# Altium schematic sheet DriverPrototype2.SchDoc: Title
size B; Organization: Midnight Sun Solar Rayce Car Team; Address1: University of Waterloo; Address2: 200 University Ave W; Address3: Waterloo, ON, Canada; Address4: N2L 3E9; Website: www.uwmidsun.com; ProjectName: ProjectName
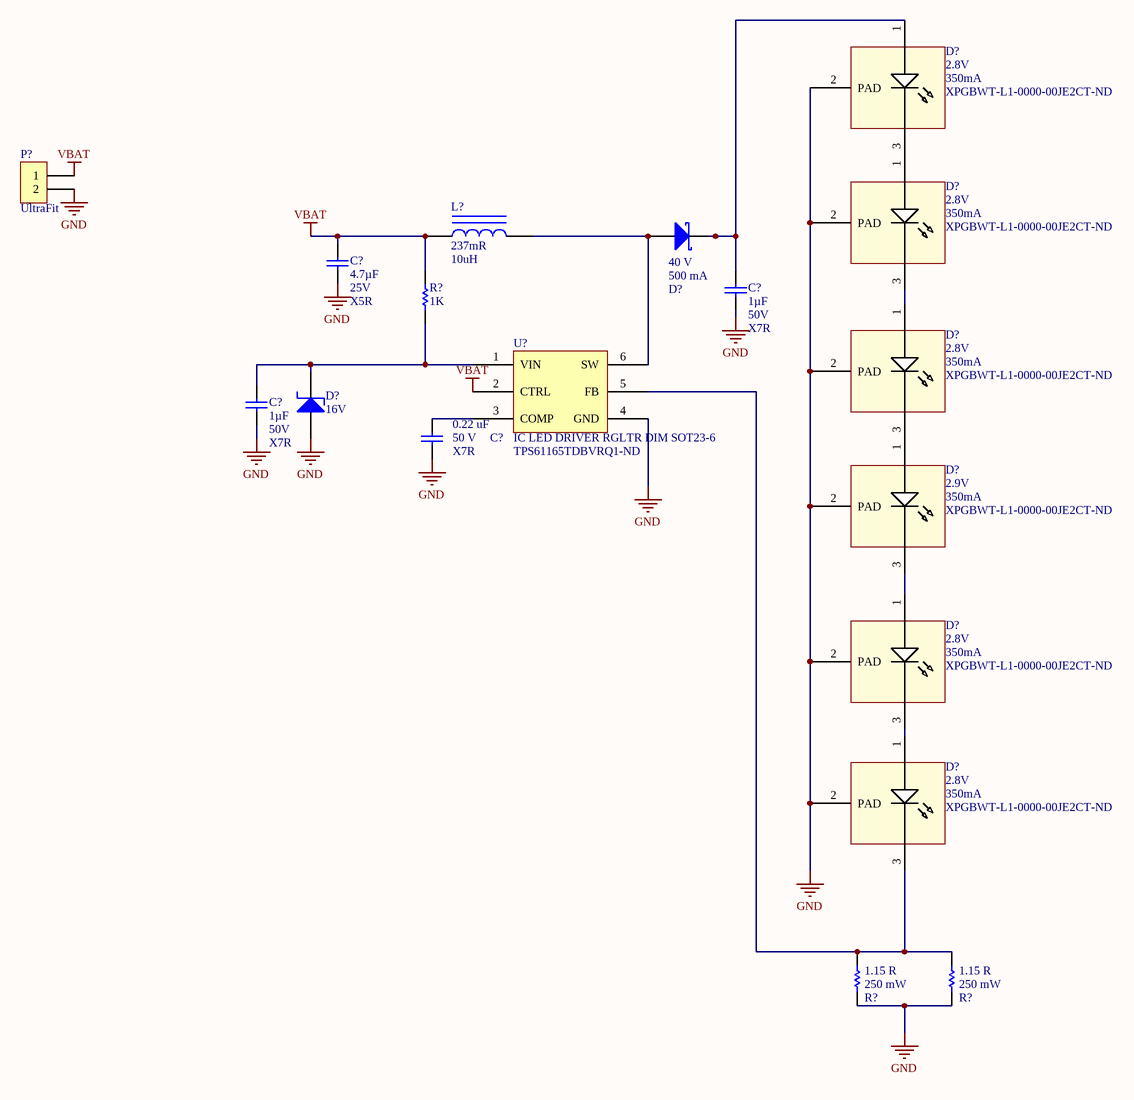
[diagram p0: DriverPrototype2.SchDoc]

## Parts
(Parts that share a designator on the sheet are numbered #1, #2 ... from top to bottom, then left to right.)
C?#1  Capacitance: 4.7µF  Voltage: 25V  Temperature Coefficient: X5R  [CAP, 0603]  (hidden comment: CAP CER 4.7UF 25V 10% X5R 0603)
C?#2  Capacitance: 1µF  Voltage: 50V  Temperature Coefficient: X7R  [CAP, 0603]  (hidden comment: CAP CER 1UF 50V 10% X7R 0603)
C?#3  Capacitance: 1µF  Voltage: 50V  Temperature Coefficient: X7R  [CAP, 0603]  (hidden comment: CAP CER 1UF 50V 10% X7R 0603)
C?#4  CAP CER 0.22UF 50V X7R 0805  [CAP, 0805]  (value not drawn)
D?#1  Forward Voltage: 2.8V  Test Current: 350mA  Supplier Part Number 1: XPGBWT-L1-0000-00JE2CT-ND  [LED CREE XP-E2 1414 2-SMD]  (hidden comment: LED XLAMP COOL WHITE 5700K 2SMD)
D?#2  Forward Voltage: 2.8V  Test Current: 350mA  Supplier Part Number 1: XPGBWT-L1-0000-00JE2CT-ND  [LED CREE XP-E2 1414 2-SMD]  (hidden comment: LED XLAMP COOL WHITE 5700K 2SMD)
D?#3  DIODE SCHOTTKY 40V 500MA SOD123  [SOD123]  (value not drawn)
D?#4  Forward Voltage: 2.8V  Test Current: 350mA  Supplier Part Number 1: XPGBWT-L1-0000-00JE2CT-ND  [LED CREE XP-E2 1414 2-SMD]  (hidden comment: LED XLAMP COOL WHITE 5700K 2SMD)
D?#5  Voltage - Zener (Nom): 16V  [DO-214AA Diode]  (hidden comment: DIODE ZENER 16V 5W DO-214AA (SMB))
D?#6  Forward Voltage: 2.9V  Test Current: 350mA  Supplier Part Number 1: XPGBWT-L1-0000-00JE2CT-ND  [LED CREE XP-E2 1414 2-SMD]  (hidden comment: LED XLAMP COOL WHITE 5700K 2SMD)
D?#7  Forward Voltage: 2.8V  Test Current: 350mA  Supplier Part Number 1: XPGBWT-L1-0000-00JE2CT-ND  [LED CREE XP-E2 1414 2-SMD]  (hidden comment: LED XLAMP COOL WHITE 5700K 2SMD)
D?#8  Forward Voltage: 2.8V  Test Current: 350mA  Supplier Part Number 1: XPGBWT-L1-0000-00JE2CT-ND  [LED CREE XP-E2 1414 2-SMD]  (hidden comment: LED XLAMP COOL WHITE 5700K 2SMD)
L?  DC Resistance (DCR): 237mR  Inductance: 10uH  [INDP5050X20N]  (hidden comment: FIXED IND 10UH 1.13A 237 MOHM)
P?  Series: UltraFit  [CONN, 2POS ULTRA-FIT]  (hidden comment: CONN 2POS ULTRA-FIT 0.138")
R?#1  1K  [RES, 0603]
R?#2  RES SMD 1.15 OHM 1% 1/4W 1206  [RES 1206]  (value not drawn)
R?#3  RES SMD 1.15 OHM 1% 1/4W 1206  [RES 1206]  (value not drawn)
U?  IC LED DRIVER RGLTR DIM SOT23-6  Supplier Part Number 1: TPS61165TDBVRQ1-ND  [SOT23-6_N]

## Nets
GND: C?#1.2 C?#2.2 C?#3.2 C?#4.2 D?#1.2(PAD) D?#2.2(PAD) D?#4.2(PAD) D?#5.1(A) D?#6.2(PAD) D?#7.2(PAD) D?#8.2(PAD) P?.2 R?#2.2 R?#3.2 U?.4(GND)
VBAT: C?#1.1 L?.1 P?.1 R?#1.1 U?.2(CTRL)
NetC?#2_1: C?#2.1 D?#1.1(A) D?#3.2(K)
NetC?#3_1: C?#3.1 D?#5.2(K) R?#1.2 U?.1(VIN)
NetC?#4_1: C?#4.1 U?.3(COMP)
NetD?#1_3: D?#1.3(K) D?#2.1(A)
NetD?#2_3: D?#2.3(K) D?#4.1(A)
NetD?#3_1: D?#3.1(A) L?.2 U?.6(SW)
NetD?#4_3: D?#4.3(K) D?#6.1(A)
NetD?#6_3: D?#6.3(K) D?#7.1(A)
NetD?#7_3: D?#7.3(K) D?#8.1(A)
NetD?#8_3: D?#8.3(K) R?#2.1 R?#3.1 U?.5(FB)

## Notes on the sheet
- PROJECT
- DOCUMENT
- DRAWN BY
- LAST MODIFIED
- PART NUMBER
- REVISION
- SHEET
- VARIANT
- OF
- Engineering 5 - 1002
  University of Waterloo
  (519) 888-4567 x32978
  hardware@uwmidsun.com
- (in symbol CAP CER 0.22UF 50V X7R 0805) 0.22 uF; 50 V
- (in symbol DIODE SCHOTTKY 40V 500MA SOD123) 40 V; 500 mA
- (in symbol RES SMD 1.15 OHM 1% 1/4W 1206) 1.15 R; 250 mW

## Library data of the parts
C?#1 = CAP CER 4.7UF 25V 10% X5R 0603: 4.7µF ±10% 25V Ceramic Capacitor X5R 0603 (1608 Metric); Manufacturer 1: Murata Electronics North America; Manufacturer Part Number 1: GRM188R61E475KE11D; Supplier 1: Digi-Key; Supplier Part Number 1: 490-7203-1-ND; Packaging: Cut Tape (CT); Part Status: Active; Operating Temperature: -55°C ~ 85°C; Ratings: -; Mounting Type: Surface Mount, MLCC; Package / Case: 0603 (1608 Metric); Size / Dimension: 0.063" L x 0.031" W (1.60mm x 0.80mm); Height - Seated (Max): -; Thickness (Max): 0.031" (0.80mm); Lead Spacing: -; Lead Style: -; ComponentLink1URL: http://www.murata.com/~/media/webrenewal/support/library/catalog/products/capacitor/mlcc/c02e.ashx; ComponentLink1Description: http://www.murata.com/~/media/webrenewal/support/library/catalog/products/capacitor/mlcc/c02e.ashx; Tolerance: ±10%
C?#2 C?#3 = CAP CER 1UF 50V 10% X7R 0603: 1µF ±10% 50V Ceramic Capacitor X7R 0603 (1608 Metric); Manufacturer 1: Taiyo Yuden; Manufacturer Part Number 1: UMK107AB7105KA-T; Supplier 1: Digi-Key; Supplier Part Number 1: 587-3247-1-ND; Packaging: Cut Tape (CT); Part Status: Active; Operating Temperature: -55°C ~ 125°C; Ratings: -; Mounting Type: Surface Mount, MLCC; Package / Case: 0603 (1608 Metric); Size / Dimension: 0.063" L x 0.031" W (1.60mm x 0.80mm); Height - Seated (Max): -; Thickness (Max): 0.037" (0.95mm); Lead Spacing: -; Lead Style: -; ComponentLink1URL: http://www.yuden.co.jp/productdata/catalog/en/mlcc_all_e.pdf; ComponentLink1Description: http://www.yuden.co.jp/productdata/catalog/en/mlcc_all_e.pdf; Tolerance: ±10%
C?#4 = CAP CER 0.22UF 50V X7R 0805: Manufacturer: Samsung; Manufacturer Part Number: CL21B224KBFNNNE; Tolerance: 10%; Capacitance: 220nF; Supplier 1: Digi-Key; Stock 1: 219478; Pricing 1: 1=0.11, 10=0.077, 100=0.0361, 500=0.02532, 1000=0.02096 (USD); Mount: Surface Mount; Case/Package: 0805; Case Code (Metric): 2012; Case Code (Imperial): 0805; Contact Plating: Tin; Min Operating Temperature: -55°C; Max Operating Temperature: 125°C; Voltage Rating: 50V; Package Quantity: 1; Packaging: Tape and Reel; Dielectric: X7R; Voltage Rating (DC): 50V; Voltage: 50V; Length: 2mm; Height: 1.25mm; Width: 0.049inch; Thickness: 0.053inch; Depth: 1.25mm; Radiation Hardening: No; Lead Free: Lead Free; ComponentLink1URL: https://www.verical.com/server-webapp/html/getDatasheet?partID=358363&src-supplier=Verical; ComponentLink1Description: https://www.verical.com/server-webapp/html/getDatasheet?partID=358363&src-supplier=Verical; Supplier Part Number 1: 1276-1093-6-ND
D?#1 D?#2 D?#4 D?#6-D?#8 = LED XLAMP COOL WHITE 5700K 2SMD: LED Lighting XLamp® XP-E2 White, Cool 5700K 2.9V 350mA 110° 1414 (3535 Metric); Manufacturer: Cree; Manufacturer Part Number: XPGBWT-L1-0000-00JE2; Max Current Rating: 1.5A; Viewing Angle: 115°; Thermal Resistance of Package: 4°C/W; ComponentLink1URL: http://www.mouser.com/ds/2/90/XLampXPE2-253473.pdf?src-supplier=Mouser; ComponentLink1Description: http://www.mouser.com/ds/2/90/XLampXPE2-253473.pdf?src-supplier=Mouser; ComponentLink2URL: http://www.cree.com/~/media/Files/Cree/LED%20Components%20and%20Modules/XLamp/Data%20and%20Binning/XLampXPE2.pdf?src-supplier=Digi-Key; ComponentLink2Description: http://www.cree.com/~/media/Files/Cree/LED%20Components%20and%20Modules/XLamp/Data%20and%20Binning/XLampXPE2.pdf?src-supplier=Digi-Key; ComponentLink3URL: https://www.verical.com/server-webapp/html/getDatasheet?partID=702662&src-supplier=Verical; ComponentLink3Description: https://www.verical.com/server-webapp/html/getDatasheet?partID=702662&src-supplier=Verical; Supplier 1: Digi-Key; RoHS: Yes; Stock 1: 6024; Pricing 1: 1 = 1.47000, 10 = 1.40100, 100 = 1.25340, 250 = 1.13988, 500 = 1.06762 (USD); Mount: Surface Mount; Case/Package: SMD/SMT; Color: White; Packaging: Tape and Reel; Correlated Color Temperature (CCT): 5700K; Length: 3.45mm; Width: 3.45mm; Lead Free: Lead Free
D?#3 = DIODE SCHOTTKY 40V 500MA SOD123: Diode Schottky 40V 500mA Surface Mount SOD-123; Manufacturer: ON Semiconductor / Fairchild; Manufacturer Part Number: MBR0540; Peak Reverse Current: 20uA; Max Surge Current: 5.5A; Forward Voltage: 620mV; Power Dissipation: 400mW; Element Configuration: Single; Polarity: Standard; Current Rating: 500A; ComponentLink1Description: datasheet; ComponentLink1URL: https://www.onsemi.cn/PowerSolutions/document/MBR0540-D.pdf; ComponentLink2Description: supplier link; ComponentLink2URL: https://www.onsemi.com/PowerSolutions/product.do?id=MBR0540; Supplier 1: Digi-Key; Stock 1: 414620; Pricing 1: 1=0.2, 10=0.166, 100=0.0881, 500=0.05794, 1000=0.0394 (USD); Mount: Surface Mount; Number of Pins: 2; Weight: 0.03g; Contact Plating: Tin,Matte; Min Operating Temperature: -65°C; Max Operating Temperature: 125°C; Forward Current: 500mA; Package Quantity: 3000; Packaging: Tape and Reel; Average Rectified Current: 500mA; Max Reverse Leakage Current: 20uA; Max Repetitive Reverse Voltage (Vrrm): 40V; Peak Non-Repetitive Surge Current: 5.5A; Max Forward Surge Current (Ifsm): 5.5A; Voltage Rating (DC): 40V; Output Current: 500mA; Max Reverse Voltage (DC): 40V; Length: 2.7mm; Height: 1.03mm; Width: 1.6mm; Radiation Hardening: No; REACH SVHC: No SVHC; Lead Free: Lead Free; ComponentLink3URL: https://www.fairchildsemi.com/datasheets/MB/MBR0540.pdf?src-supplier=Digi-Key; ComponentLink3Description: https://www.fairchildsemi.com/datasheets/MB/MBR0540.pdf?src-supplier=Digi-Key; ComponentLink4URL: https://www.onsemi.cn/PowerSolutions/document/MBR0540-D.pdf?src-supplier=Digi-Key; ComponentLink4Description: https://www.onsemi.cn/PowerSolutions/document/MBR0540-D.pdf?src-supplier=Digi-Key; ComponentLink5URL: http://www.jameco.com/Jameco/Products/ProdDS/975060.pdf?src-supplier=Jameco; ComponentLink5Description: http://www.jameco.com/Jameco/Products/ProdDS/975060.pdf?src-supplier=Jameco; ComponentLink6URL: http://www.mouser.com/ds/2/149/MBR0540-90522.pdf?src-supplier=Mouser; ComponentLink6Description: http://www.mouser.com/ds/2/149/MBR0540-90522.pdf?src-supplier=Mouser; ComponentLink7URL: https://www.verical.com/server-webapp/html/getDatasheet?partID=110131&src-supplier=Verical; ComponentLink7Description: https://www.verical.com/server-webapp/html/getDatasheet?partID=110131&src-supplier=Verical; ComponentLink8URL: http://www.farnell.com/datasheets/2041480.pdf?src-supplier=Element14; ComponentLink8Description: http://www.farnell.com/datasheets/2041480.pdf?src-supplier=Element14; ComponentLink9URL: https://www.fairchildsemi.com/datasheets/MB/MBR0540.pdf?src-supplier=Avnet; ComponentLink9Description: https://www.fairchildsemi.com/datasheets/MB/MBR0540.pdf?src-supplier=Avnet; Supplier Part Number 1: MBR0540DKR-ND
D?#5 = DIODE ZENER 16V 5W DO-214AA (SMB): Zener Diode 16V 5W ±5% Surface Mount DO-214AA (SMB); Manufacture: Micro Commercial Co; Manufacture Part Number: SMBJ5353B-TP; Impedence (Max): 2.5 Ohm; Voltage - Forward: 1.2V @ 1A; Power (Max): 5W; Supplier 1: Digi-Key; Supplier Part Number 1: SMBJ5353B-TPMSCT-ND
L? = FIXED IND 10UH 1.13A 237 MOHM: 10µH Shielded Wirewound Inductor 1.13A 237mOhm Max Nonstandard; Manufacturer: TDK; Manufacturer Part Number: VLCF5020T-100M1R1-1; Core Material: Ferrite; Inductance Tolerance: 20%; Test Frequency: 100kHz; RMS Current (Irms): 1.5A; Supplier 1: Digi-Key; Stock 1: 12500; Pricing 1: 500=0.441, 1000=0.357, 2500=0.336, 5000=0.3255, 12500=0.315, 25000=0.3045 (USD); Mount: Surface Mount; Case/Package: 2020; Number of Pins: 2; Min Operating Temperature: -40°C; Max Operating Temperature: 105°C; Packaging: Tape and Reel; Tolerance: 20%; Package Quantity: 500; Current Rating: 1.13A; Saturation Current: 1.13A; Shielding: Shielded; Composition: Wirewound; Max DC Current: 1.13A; Termination: SMD/SMT; DC Current: 1.13A; Military Standard: Not; Length: 0.197inch; Height: 2mm; Width: 0.197inch; Height - Seated (Max): 0.079inch; Depth: 5.2mm; Radiation Hardening: No; REACH SVHC: No SVHC; Lead Free: Lead Free; ComponentLink1URL: http://www.onlinecomponents.com/productFiles/mf-TDK/e531_vlcf5020_1.pdf?src-supplier=Onlinecomponents.com; ComponentLink1Description: http://www.onlinecomponents.com/productFiles/mf-TDK/e531_vlcf5020_1.pdf?src-supplier=Onlinecomponents.com; ComponentLink2URL: http://www.mouser.com/ds/2/400/e531_vlcf-18500.pdf?src-supplier=Mouser; ComponentLink2Description: http://www.mouser.com/ds/2/400/e531_vlcf-18500.pdf?src-supplier=Mouser; ComponentLink3URL: http://www.farnell.com/datasheets/516785.pdf?src-supplier=Element14; ComponentLink3Description: http://www.farnell.com/datasheets/516785.pdf?src-supplier=Element14; ComponentLink4URL: http://uk.rs-online.com/webdocs/1538/0900766b81538dbe.pdf?src-supplier=RSComponents; ComponentLink4Description: http://uk.rs-online.com/webdocs/1538/0900766b81538dbe.pdf?src-supplier=RSComponents; ComponentLink5URL: https://www.verical.com/server-webapp/html/getDatasheet?partID=107508&src-supplier=Verical; ComponentLink5Description: https://www.verical.com/server-webapp/html/getDatasheet?partID=107508&src-supplier=Verical; Supplier Part Number 1: 445-3209-2-ND
P? = CONN 2POS ULTRA-FIT 0.138": Connector Header Through Hole 2 position 0.138" (3.50mm); Manufacturer: Molex; Manufacturer Part Number: 1722871102; Number of Positions: 2; Connector Type: Male Pin; Pitch: 0.138inch; ComponentLink1URL: http://www.molex.com/pdm_docs/sd/1722861302_sd.pdf; ComponentLink1Description: http://www.molex.com/pdm_docs/sd/1722861302_sd.pdf; Supplier 1: Digi-Key; RoHS: Yes; Stock 1: 2743; Pricing 1: 1 = 0.78000, 10 = 0.68800, 100 = 0.59380, 500 = 0.48582, 1000 = 0.43184, 5000 = 0.37786, 10000 = 0.35897 (USD); Mount: Through Hole; Color: Black; Contact Plating: Tin; Packaging: Tray; Number of Rows: 1; Termination: Solder; Fastening Type: Latch; Supplier Part Number 1: WM11701-ND
R?#1 = RES 1K OHM 5% 1/10W 0603: 1k Ohm ±5% 0.1W, 1/10W Chip Resistor 0603 (1608 Metric); Manufacturer: Yageo; Manufacturer Part Number: RC0603JR-071KL; Temperature Coefficient: ±100ppm/°C; Supplier 1: Digi-Key; Supplier Part Number 1: 311-1.0KGRCT-ND; RoHS: RoHS Compliant; Category: Resistors; Stock 1: 4415240; Pricing 1: 1=0.15, 10=0.017, 100=0.0071, 1000=0.0032, 2500=0.00278 (CAD); Packaging: Cut Tape (CT); Part Status: Active; Resistance (Ohms): 1k; Tolerance: ±5%; Power (Watts): 0.1W, 1/10W; Composition: Thick Film; Features: Moisture Resistant; Operating Temperature: -55°C ~ 155°C; Package / Case: 0603 (1608 Metric); Supplier Device Package: 0603; Size / Dimension: 0.063" L x 0.031" W (1.60mm x 0.80mm); Height - Seated (Max): 0.022" (0.55mm); Failure Rate: -; ComponentLink1URL: http://www.yageo.com/documents/recent/PYu-RC_Group_51_RoHS_L_7.pdf; ComponentLink1Description: http://www.yageo.com/documents/recent/PYu-RC_Group_51_RoHS_L_7.pdf
R?#2 R?#3 = RES SMD 1.15 OHM 1% 1/4W 1206: Manufacturer: Yageo; Manufacturer Part Number: RC1206FR-071R15L; Resistance: 1.15R; Temperature Coefficient: 200ppm/°C; Voltage Rating (DC): 200V; Supplier 1: Digi-Key; Stock 1: 34622; Pricing 1: 1=0.15, 10=0.133, 100=0.0512, 1000=0.02252, 2500=0.01945 (USD); Case/Package: 1206; Contact Plating: Tin,Matte; Min Operating Temperature: -55°C; Max Operating Temperature: 155°C; Tolerance: 1%; Composition: Thick Film; Radiation Hardening: No; Lead Free: Lead Free; Supplier Part Number 1: 311-1.15FRDKR-ND
U? = IC LED DRIVER RGLTR DIM SOT23-6: LED Driver IC 1 Output DC DC Regulator Step-Up (Boost) PWM Dimming 1.2A (Switch) SOT-23-6; Manufacturer: Texas Instruments; Manufacturer Part Number: TPS61165TDBVRQ1; Number of Outputs: 1; Max Supply Voltage: 18V; Frequency: 1.2MHz; Min Input Voltage: 3V; Output Voltage: 38V; Number of Segments: 3; Max Supply Current: 2.3mA; Quiescent Current: 1.5mA; ComponentLink1Description: datasheet; ComponentLink1URL: http://www.ti.com/lit/ds/symlink/tps61165.pdf; Supplier 1: Digi-Key; Stock 1: 0; Case/Package: SOT-23-6; Number of Pins: 6; Min Operating Temperature: -40°C; Max Operating Temperature: 105°C; Packaging: Tape and Reel; Topology: Boost; Max Input Voltage: 18V; Output Current per Channel: 1.2A; Output Current: 1.2A; Package Quantity: 3000; Dimming: PWM; Min Supply Voltage: 3V; Number of Channels: 1; Radiation Hardening: No; Lead Free: Lead Free; ComponentLink2URL: http://www.ti.com/lit/gpn/tps61165-q1?src-supplier=Mouser; ComponentLink2Description: http://www.ti.com/lit/gpn/tps61165-q1?src-supplier=Mouser; ComponentLink3URL: https://www.verical.com/server-webapp/html/getDatasheet?partID=676299&src-supplier=Verical; ComponentLink3Description: https://www.verical.com/server-webapp/html/getDatasheet?partID=676299&src-supplier=Verical; ComponentLink4URL: http://www.ti.com/lit/ds/symlink/tps61165-q1.pdf?src-supplier=Digi-Key; ComponentLink4Description: http://www.ti.com/lit/ds/symlink/tps61165-q1.pdf?src-supplier=Digi-Key